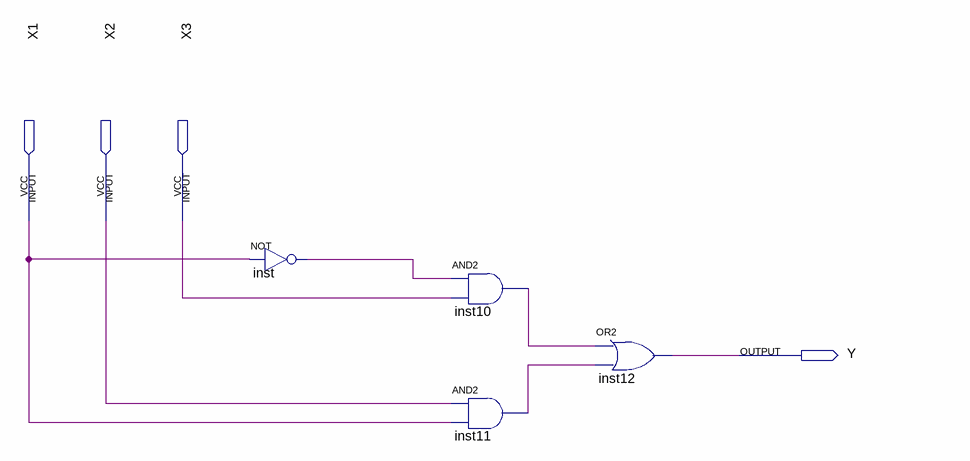
[diagram p0: schematic sheet]
// Quartus schematic lab2_3.bdf as structural Verilog: 4 symbols, 4 pins
module lab2_3 (
  input  X1,
  input  X2,
  input  X3,
  output Y
);

  wire inst10_out, inst11_out, inst_out;

  not inst (inst_out, X1);
  and inst10 (inst10_out, inst_out, X3);
  and inst11 (inst11_out, X2, X1);
  or inst12 (Y, inst10_out, inst11_out);
endmodule
